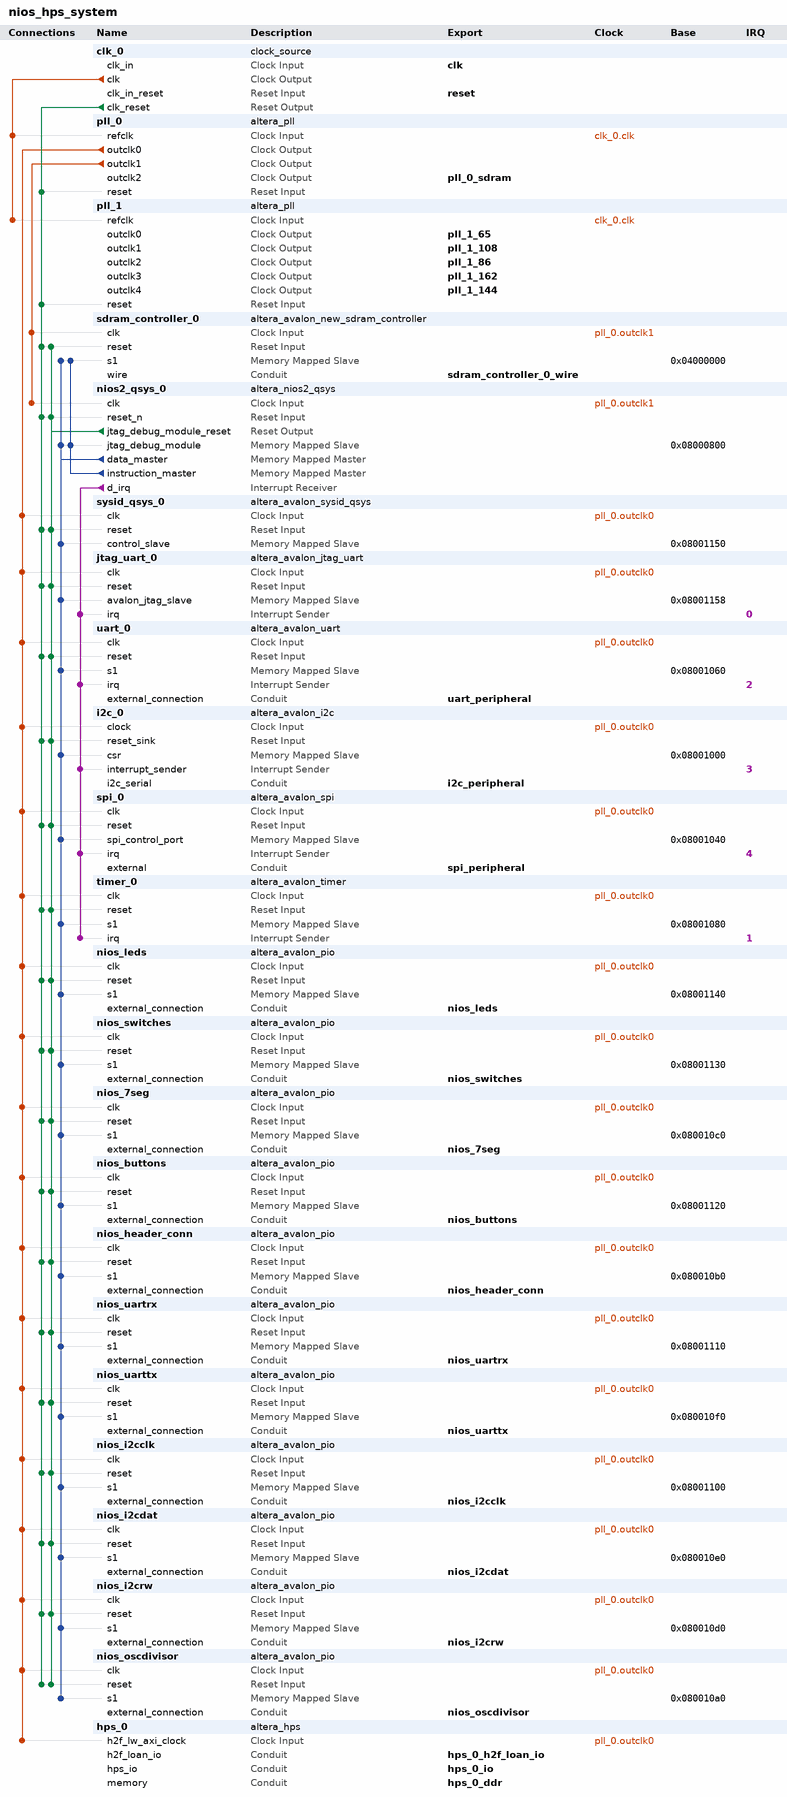
[diagram p0: system contents]
# Platform Designer (Qsys) system nios_hps_system, Cyclone V 5CSEMA5F31C6
# Parameters at their usual value, and those the tool derives, are not listed.
package require -exact qsys 18.1
create_system nios_hps_system
set_project_property DEVICE_FAMILY {Cyclone V}
set_project_property DEVICE 5CSEMA5F31C6

add_instance clk_0 clock_source 18.1
set_instance_parameter_value clk_0 clockFrequency 50000000

add_instance pll_0 altera_pll 18.1
set_instance_parameter_value pll_0 gui_device_speed_grade 1
set_instance_parameter_value pll_0 gui_number_of_clocks 3
set_instance_parameter_value pll_0 gui_operation_mode direct
set_instance_parameter_value pll_0 gui_output_clock_frequency0 50.0
set_instance_parameter_value pll_0 gui_output_clock_frequency1 100.0
set_instance_parameter_value pll_0 gui_output_clock_frequency2 100.0
set_instance_parameter_value pll_0 gui_phase_shift2 -3758
set_instance_parameter_value pll_0 gui_pll_mode {Integer-N PLL}
set_instance_parameter_value pll_0 gui_reference_clock_frequency 50.0
set_instance_parameter_value pll_0 gui_use_locked false

add_instance pll_1 altera_pll 18.1
set_instance_parameter_value pll_1 gui_device_speed_grade 1
set_instance_parameter_value pll_1 gui_number_of_clocks 5
set_instance_parameter_value pll_1 gui_operation_mode direct
set_instance_parameter_value pll_1 gui_output_clock_frequency0 65.0
set_instance_parameter_value pll_1 gui_output_clock_frequency1 108.0
set_instance_parameter_value pll_1 gui_output_clock_frequency2 85.5
set_instance_parameter_value pll_1 gui_output_clock_frequency3 162.0
set_instance_parameter_value pll_1 gui_pll_mode {Integer-N PLL}
set_instance_parameter_value pll_1 gui_reference_clock_frequency 50.0
set_instance_parameter_value pll_1 gui_use_locked false

add_instance sdram_controller_0 altera_avalon_new_sdram_controller 18.1
set_instance_parameter_value sdram_controller_0 TAC 5.4
set_instance_parameter_value sdram_controller_0 TRCD 15.0
set_instance_parameter_value sdram_controller_0 TRP 15.0
set_instance_parameter_value sdram_controller_0 casLatency 3
set_instance_parameter_value sdram_controller_0 columnWidth 10
set_instance_parameter_value sdram_controller_0 dataWidth 16
set_instance_parameter_value sdram_controller_0 generateSimulationModel false
set_instance_parameter_value sdram_controller_0 model single_Micron_MT48LC4M32B2_7_chip
set_instance_parameter_value sdram_controller_0 numberOfBanks 4
set_instance_parameter_value sdram_controller_0 numberOfChipSelects 1
set_instance_parameter_value sdram_controller_0 powerUpDelay 100.0
set_instance_parameter_value sdram_controller_0 refreshPeriod 7.8125
set_instance_parameter_value sdram_controller_0 rowWidth 13

add_instance nios2_qsys_0 altera_nios2_qsys 16.1
set_instance_parameter_value nios2_qsys_0 breakSlave nios2_qsys_0.jtag_debug_module
set_instance_parameter_value nios2_qsys_0 exceptionSlave sdram_controller_0.s1
set_instance_parameter_value nios2_qsys_0 icache_size 4096
set_instance_parameter_value nios2_qsys_0 impl Tiny
set_instance_parameter_value nios2_qsys_0 mmu_TLBMissExcSlave None
set_instance_parameter_value nios2_qsys_0 resetSlave sdram_controller_0.s1
set_instance_parameter_value nios2_qsys_0 resetrequest_enabled true

add_instance sysid_qsys_0 altera_avalon_sysid_qsys 18.1
set_instance_parameter_value sysid_qsys_0 id 0

add_instance jtag_uart_0 altera_avalon_jtag_uart 18.1
set_instance_parameter_value jtag_uart_0 simInteractiveOptions NO_INTERACTIVE_WINDOWS

add_instance uart_0 altera_avalon_uart 18.1
set_instance_parameter_value uart_0 baud 115200
set_instance_parameter_value uart_0 dataBits 8
set_instance_parameter_value uart_0 fixedBaud false
set_instance_parameter_value uart_0 parity EVEN
set_instance_parameter_value uart_0 stopBits 1

add_instance i2c_0 altera_avalon_i2c 18.1
set_instance_parameter_value i2c_0 FIFO_DEPTH 4

add_instance spi_0 altera_avalon_spi 18.1
set_instance_parameter_value spi_0 clockPolarity 0
set_instance_parameter_value spi_0 dataWidth 8
set_instance_parameter_value spi_0 masterSPI true
set_instance_parameter_value spi_0 numberOfSlaves 1
set_instance_parameter_value spi_0 targetClockRate 128000

add_instance timer_0 altera_avalon_timer 18.1
set_instance_parameter_value timer_0 period 1
set_instance_parameter_value timer_0 periodUnits MSEC

add_instance nios_leds altera_avalon_pio 18.1
set_instance_parameter_value nios_leds direction Output
set_instance_parameter_value nios_leds width 10

add_instance nios_switches altera_avalon_pio 18.1
set_instance_parameter_value nios_switches direction Input
set_instance_parameter_value nios_switches width 10

add_instance nios_7seg altera_avalon_pio 18.1
set_instance_parameter_value nios_7seg direction Output
set_instance_parameter_value nios_7seg width 24

add_instance nios_buttons altera_avalon_pio 18.1
set_instance_parameter_value nios_buttons direction Input
set_instance_parameter_value nios_buttons width 4

add_instance nios_header_conn altera_avalon_pio 18.1
set_instance_parameter_value nios_header_conn direction InOut
set_instance_parameter_value nios_header_conn width 32

add_instance nios_uartrx altera_avalon_pio 18.1
set_instance_parameter_value nios_uartrx direction Input
set_instance_parameter_value nios_uartrx width 1

add_instance nios_uarttx altera_avalon_pio 18.1
set_instance_parameter_value nios_uarttx direction Output
set_instance_parameter_value nios_uarttx width 1

add_instance nios_i2cclk altera_avalon_pio 18.1
set_instance_parameter_value nios_i2cclk direction Output
set_instance_parameter_value nios_i2cclk width 1

add_instance nios_i2cdat altera_avalon_pio 18.1
set_instance_parameter_value nios_i2cdat direction InOut
set_instance_parameter_value nios_i2cdat width 1

add_instance nios_i2crw altera_avalon_pio 18.1
set_instance_parameter_value nios_i2crw direction Output
set_instance_parameter_value nios_i2crw width 1

add_instance nios_oscdivisor altera_avalon_pio 18.1
set_instance_parameter_value nios_oscdivisor direction Output
set_instance_parameter_value nios_oscdivisor width 16

add_instance hps_0 altera_hps 18.1
set_instance_parameter_value hps_0 EMAC1_Mode N/A
set_instance_parameter_value hps_0 EMAC1_PinMuxing Unused
set_instance_parameter_value hps_0 F2SCLK_COLDRST_Enable false
set_instance_parameter_value hps_0 F2SCLK_DBGRST_Enable false
set_instance_parameter_value hps_0 F2SCLK_WARMRST_Enable false
set_instance_parameter_value hps_0 F2SINTERRUPT_Enable false
set_instance_parameter_value hps_0 F2S_Width 0
set_instance_parameter_value hps_0 FPGA_PERIPHERAL_OUTPUT_CLOCK_FREQ_EMAC0_GTX_CLK 125
set_instance_parameter_value hps_0 FPGA_PERIPHERAL_OUTPUT_CLOCK_FREQ_EMAC0_MD_CLK 2.5
set_instance_parameter_value hps_0 FPGA_PERIPHERAL_OUTPUT_CLOCK_FREQ_EMAC1_GTX_CLK 125
set_instance_parameter_value hps_0 FPGA_PERIPHERAL_OUTPUT_CLOCK_FREQ_EMAC1_MD_CLK 2.5
set_instance_parameter_value hps_0 HPS_PROTOCOL DDR3
set_instance_parameter_value hps_0 I2C0_Mode N/A
set_instance_parameter_value hps_0 I2C0_PinMuxing Unused
set_instance_parameter_value hps_0 I2C1_Mode N/A
set_instance_parameter_value hps_0 I2C1_PinMuxing Unused
set_instance_parameter_value hps_0 LWH2F_Enable true
set_instance_parameter_value hps_0 MEM_BANKADDR_WIDTH 3
set_instance_parameter_value hps_0 MEM_CLK_FREQ 400.0
set_instance_parameter_value hps_0 MEM_COL_ADDR_WIDTH 10
set_instance_parameter_value hps_0 MEM_DQ_WIDTH 32
set_instance_parameter_value hps_0 MEM_DRV_STR RZQ/7
set_instance_parameter_value hps_0 MEM_ROW_ADDR_WIDTH 15
set_instance_parameter_value hps_0 MEM_RTT_NOM RZQ/4
set_instance_parameter_value hps_0 MEM_RTT_WR RZQ/4
set_instance_parameter_value hps_0 MEM_TCL 11
set_instance_parameter_value hps_0 MEM_TFAW_NS 30.0
set_instance_parameter_value hps_0 MEM_TRAS_NS 35.0
set_instance_parameter_value hps_0 MEM_TRCD_NS 13.75
set_instance_parameter_value hps_0 MEM_TRFC_NS 260.0
set_instance_parameter_value hps_0 MEM_TRP_NS 13.75
set_instance_parameter_value hps_0 MEM_VENDOR Other
set_instance_parameter_value hps_0 MEM_WTCL 8
set_instance_parameter_value hps_0 QSPI_Mode N/A
set_instance_parameter_value hps_0 QSPI_PinMuxing Unused
set_instance_parameter_value hps_0 REF_CLK_FREQ 25.0
set_instance_parameter_value hps_0 S2FCLK_USER2CLK 5
set_instance_parameter_value hps_0 S2F_Width 0
set_instance_parameter_value hps_0 SDIO_Mode {4-bit Data}
set_instance_parameter_value hps_0 SDIO_PinMuxing {HPS I/O Set 0}
set_instance_parameter_value hps_0 SPIM1_Mode N/A
set_instance_parameter_value hps_0 SPIM1_PinMuxing Unused
set_instance_parameter_value hps_0 STM_Enable false
set_instance_parameter_value hps_0 TIMING_BOARD_AC_SKEW 0.02
set_instance_parameter_value hps_0 TIMING_BOARD_AC_TO_CK_SKEW 0.01
set_instance_parameter_value hps_0 TIMING_BOARD_DQ_TO_DQS_SKEW 0.05
set_instance_parameter_value hps_0 TIMING_BOARD_MAX_CK_DELAY 0.03
set_instance_parameter_value hps_0 TIMING_BOARD_MAX_DQS_DELAY 0.02
set_instance_parameter_value hps_0 TIMING_BOARD_SKEW_BETWEEN_DQS 0.06
set_instance_parameter_value hps_0 TIMING_BOARD_SKEW_CKDQS_DIMM_MAX 0.12
set_instance_parameter_value hps_0 TIMING_BOARD_SKEW_CKDQS_DIMM_MIN 0.06
set_instance_parameter_value hps_0 TIMING_BOARD_SKEW_WITHIN_DQS 0.01
set_instance_parameter_value hps_0 TIMING_TDH 65
set_instance_parameter_value hps_0 TIMING_TDQSCK 255
set_instance_parameter_value hps_0 TIMING_TDQSQ 125
set_instance_parameter_value hps_0 TIMING_TDS 30
set_instance_parameter_value hps_0 TIMING_TIH 140
set_instance_parameter_value hps_0 TIMING_TIS 180
set_instance_parameter_value hps_0 TIMING_TQSH 0.4
set_instance_parameter_value hps_0 UART0_Mode N/A
set_instance_parameter_value hps_0 UART0_PinMuxing Unused
set_instance_parameter_value hps_0 USB1_Mode N/A
set_instance_parameter_value hps_0 USB1_PinMuxing Unused
set_instance_parameter_value hps_0 desired_cfg_clk_mhz 100.0
set_instance_parameter_value hps_0 desired_qspi_clk_mhz 400.0

# connections
add_connection clk_0.clk pll_0.refclk clock
add_connection clk_0.clk pll_1.refclk clock
add_connection pll_0.outclk0 hps_0.h2f_lw_axi_clock clock
add_connection pll_0.outclk0 i2c_0.clock clock
add_connection pll_0.outclk0 jtag_uart_0.clk clock
add_connection pll_0.outclk0 nios_7seg.clk clock
add_connection pll_0.outclk0 nios_buttons.clk clock
add_connection pll_0.outclk0 nios_header_conn.clk clock
add_connection pll_0.outclk0 nios_i2cclk.clk clock
add_connection pll_0.outclk0 nios_i2cdat.clk clock
add_connection pll_0.outclk0 nios_i2crw.clk clock
add_connection pll_0.outclk0 nios_leds.clk clock
add_connection pll_0.outclk0 nios_oscdivisor.clk clock
add_connection pll_0.outclk0 nios_switches.clk clock
add_connection pll_0.outclk0 nios_uartrx.clk clock
add_connection pll_0.outclk0 nios_uarttx.clk clock
add_connection pll_0.outclk0 spi_0.clk clock
add_connection pll_0.outclk0 sysid_qsys_0.clk clock
add_connection pll_0.outclk0 timer_0.clk clock
add_connection pll_0.outclk0 uart_0.clk clock
add_connection pll_0.outclk1 nios2_qsys_0.clk clock
add_connection pll_0.outclk1 sdram_controller_0.clk clock
add_connection clk_0.clk_reset i2c_0.reset_sink reset
add_connection clk_0.clk_reset jtag_uart_0.reset reset
add_connection clk_0.clk_reset nios2_qsys_0.reset_n reset
add_connection clk_0.clk_reset nios_7seg.reset reset
add_connection clk_0.clk_reset nios_buttons.reset reset
add_connection clk_0.clk_reset nios_header_conn.reset reset
add_connection clk_0.clk_reset nios_i2cclk.reset reset
add_connection clk_0.clk_reset nios_i2cdat.reset reset
add_connection clk_0.clk_reset nios_i2crw.reset reset
add_connection clk_0.clk_reset nios_leds.reset reset
add_connection clk_0.clk_reset nios_oscdivisor.reset reset
add_connection clk_0.clk_reset nios_switches.reset reset
add_connection clk_0.clk_reset nios_uartrx.reset reset
add_connection clk_0.clk_reset nios_uarttx.reset reset
add_connection clk_0.clk_reset pll_0.reset reset
add_connection clk_0.clk_reset pll_1.reset reset
add_connection clk_0.clk_reset sdram_controller_0.reset reset
add_connection clk_0.clk_reset spi_0.reset reset
add_connection clk_0.clk_reset sysid_qsys_0.reset reset
add_connection clk_0.clk_reset timer_0.reset reset
add_connection clk_0.clk_reset uart_0.reset reset
add_connection nios2_qsys_0.jtag_debug_module_reset i2c_0.reset_sink reset
add_connection nios2_qsys_0.jtag_debug_module_reset jtag_uart_0.reset reset
add_connection nios2_qsys_0.jtag_debug_module_reset nios2_qsys_0.reset_n reset
add_connection nios2_qsys_0.jtag_debug_module_reset nios_7seg.reset reset
add_connection nios2_qsys_0.jtag_debug_module_reset nios_buttons.reset reset
add_connection nios2_qsys_0.jtag_debug_module_reset nios_header_conn.reset reset
add_connection nios2_qsys_0.jtag_debug_module_reset nios_i2cclk.reset reset
add_connection nios2_qsys_0.jtag_debug_module_reset nios_i2cdat.reset reset
add_connection nios2_qsys_0.jtag_debug_module_reset nios_i2crw.reset reset
add_connection nios2_qsys_0.jtag_debug_module_reset nios_leds.reset reset
add_connection nios2_qsys_0.jtag_debug_module_reset nios_oscdivisor.reset reset
add_connection nios2_qsys_0.jtag_debug_module_reset nios_switches.reset reset
add_connection nios2_qsys_0.jtag_debug_module_reset nios_uartrx.reset reset
add_connection nios2_qsys_0.jtag_debug_module_reset nios_uarttx.reset reset
add_connection nios2_qsys_0.jtag_debug_module_reset sdram_controller_0.reset reset
add_connection nios2_qsys_0.jtag_debug_module_reset spi_0.reset reset
add_connection nios2_qsys_0.jtag_debug_module_reset sysid_qsys_0.reset reset
add_connection nios2_qsys_0.jtag_debug_module_reset timer_0.reset reset
add_connection nios2_qsys_0.jtag_debug_module_reset uart_0.reset reset
add_connection nios2_qsys_0.data_master i2c_0.csr avalon
set_connection_parameter_value nios2_qsys_0.data_master/i2c_0.csr baseAddress 0x08001000
add_connection nios2_qsys_0.data_master jtag_uart_0.avalon_jtag_slave avalon
set_connection_parameter_value nios2_qsys_0.data_master/jtag_uart_0.avalon_jtag_slave baseAddress 0x08001158
add_connection nios2_qsys_0.data_master nios2_qsys_0.jtag_debug_module avalon
set_connection_parameter_value nios2_qsys_0.data_master/nios2_qsys_0.jtag_debug_module baseAddress 0x08000800
add_connection nios2_qsys_0.data_master nios_7seg.s1 avalon
set_connection_parameter_value nios2_qsys_0.data_master/nios_7seg.s1 baseAddress 0x080010c0
add_connection nios2_qsys_0.data_master nios_buttons.s1 avalon
set_connection_parameter_value nios2_qsys_0.data_master/nios_buttons.s1 baseAddress 0x08001120
add_connection nios2_qsys_0.data_master nios_header_conn.s1 avalon
set_connection_parameter_value nios2_qsys_0.data_master/nios_header_conn.s1 baseAddress 0x080010b0
add_connection nios2_qsys_0.data_master nios_i2cclk.s1 avalon
set_connection_parameter_value nios2_qsys_0.data_master/nios_i2cclk.s1 baseAddress 0x08001100
add_connection nios2_qsys_0.data_master nios_i2cdat.s1 avalon
set_connection_parameter_value nios2_qsys_0.data_master/nios_i2cdat.s1 baseAddress 0x080010e0
add_connection nios2_qsys_0.data_master nios_i2crw.s1 avalon
set_connection_parameter_value nios2_qsys_0.data_master/nios_i2crw.s1 baseAddress 0x080010d0
add_connection nios2_qsys_0.data_master nios_leds.s1 avalon
set_connection_parameter_value nios2_qsys_0.data_master/nios_leds.s1 baseAddress 0x08001140
add_connection nios2_qsys_0.data_master nios_oscdivisor.s1 avalon
set_connection_parameter_value nios2_qsys_0.data_master/nios_oscdivisor.s1 baseAddress 0x080010a0
add_connection nios2_qsys_0.data_master nios_switches.s1 avalon
set_connection_parameter_value nios2_qsys_0.data_master/nios_switches.s1 baseAddress 0x08001130
add_connection nios2_qsys_0.data_master nios_uartrx.s1 avalon
set_connection_parameter_value nios2_qsys_0.data_master/nios_uartrx.s1 baseAddress 0x08001110
add_connection nios2_qsys_0.data_master nios_uarttx.s1 avalon
set_connection_parameter_value nios2_qsys_0.data_master/nios_uarttx.s1 baseAddress 0x080010f0
add_connection nios2_qsys_0.data_master sdram_controller_0.s1 avalon
set_connection_parameter_value nios2_qsys_0.data_master/sdram_controller_0.s1 baseAddress 0x04000000
add_connection nios2_qsys_0.data_master spi_0.spi_control_port avalon
set_connection_parameter_value nios2_qsys_0.data_master/spi_0.spi_control_port baseAddress 0x08001040
add_connection nios2_qsys_0.data_master sysid_qsys_0.control_slave avalon
set_connection_parameter_value nios2_qsys_0.data_master/sysid_qsys_0.control_slave baseAddress 0x08001150
add_connection nios2_qsys_0.data_master timer_0.s1 avalon
set_connection_parameter_value nios2_qsys_0.data_master/timer_0.s1 baseAddress 0x08001080
add_connection nios2_qsys_0.data_master uart_0.s1 avalon
set_connection_parameter_value nios2_qsys_0.data_master/uart_0.s1 baseAddress 0x08001060
add_connection nios2_qsys_0.instruction_master nios2_qsys_0.jtag_debug_module avalon
set_connection_parameter_value nios2_qsys_0.instruction_master/nios2_qsys_0.jtag_debug_module baseAddress 0x08000800
add_connection nios2_qsys_0.instruction_master sdram_controller_0.s1 avalon
set_connection_parameter_value nios2_qsys_0.instruction_master/sdram_controller_0.s1 baseAddress 0x04000000
add_connection nios2_qsys_0.d_irq i2c_0.interrupt_sender interrupt
set_connection_parameter_value nios2_qsys_0.d_irq/i2c_0.interrupt_sender irqNumber 3
add_connection nios2_qsys_0.d_irq jtag_uart_0.irq interrupt
set_connection_parameter_value nios2_qsys_0.d_irq/jtag_uart_0.irq irqNumber 0
add_connection nios2_qsys_0.d_irq spi_0.irq interrupt
set_connection_parameter_value nios2_qsys_0.d_irq/spi_0.irq irqNumber 4
add_connection nios2_qsys_0.d_irq timer_0.irq interrupt
set_connection_parameter_value nios2_qsys_0.d_irq/timer_0.irq irqNumber 1
add_connection nios2_qsys_0.d_irq uart_0.irq interrupt
set_connection_parameter_value nios2_qsys_0.d_irq/uart_0.irq irqNumber 2

# exported interfaces
add_interface clk clock sink
set_interface_property clk EXPORT_OF clk_0.clk_in
add_interface hps_0_ddr conduit end
set_interface_property hps_0_ddr EXPORT_OF hps_0.memory
add_interface hps_0_h2f_loan_io conduit end
set_interface_property hps_0_h2f_loan_io EXPORT_OF hps_0.h2f_loan_io
add_interface hps_0_io conduit end
set_interface_property hps_0_io EXPORT_OF hps_0.hps_io
add_interface i2c_peripheral conduit end
set_interface_property i2c_peripheral EXPORT_OF i2c_0.i2c_serial
add_interface nios_7seg conduit end
set_interface_property nios_7seg EXPORT_OF nios_7seg.external_connection
add_interface nios_buttons conduit end
set_interface_property nios_buttons EXPORT_OF nios_buttons.external_connection
add_interface nios_header_conn conduit end
set_interface_property nios_header_conn EXPORT_OF nios_header_conn.external_connection
add_interface nios_i2cclk conduit end
set_interface_property nios_i2cclk EXPORT_OF nios_i2cclk.external_connection
add_interface nios_i2cdat conduit end
set_interface_property nios_i2cdat EXPORT_OF nios_i2cdat.external_connection
add_interface nios_i2crw conduit end
set_interface_property nios_i2crw EXPORT_OF nios_i2crw.external_connection
add_interface nios_leds conduit end
set_interface_property nios_leds EXPORT_OF nios_leds.external_connection
add_interface nios_oscdivisor conduit end
set_interface_property nios_oscdivisor EXPORT_OF nios_oscdivisor.external_connection
add_interface nios_switches conduit end
set_interface_property nios_switches EXPORT_OF nios_switches.external_connection
add_interface nios_uartrx conduit end
set_interface_property nios_uartrx EXPORT_OF nios_uartrx.external_connection
add_interface nios_uarttx conduit end
set_interface_property nios_uarttx EXPORT_OF nios_uarttx.external_connection
add_interface pll_0_sdram clock source
set_interface_property pll_0_sdram EXPORT_OF pll_0.outclk2
add_interface pll_1_108 clock source
set_interface_property pll_1_108 EXPORT_OF pll_1.outclk1
add_interface pll_1_144 clock source
set_interface_property pll_1_144 EXPORT_OF pll_1.outclk4
add_interface pll_1_162 clock source
set_interface_property pll_1_162 EXPORT_OF pll_1.outclk3
add_interface pll_1_65 clock source
set_interface_property pll_1_65 EXPORT_OF pll_1.outclk0
add_interface pll_1_86 clock source
set_interface_property pll_1_86 EXPORT_OF pll_1.outclk2
add_interface reset reset sink
set_interface_property reset EXPORT_OF clk_0.clk_in_reset
add_interface sdram_controller_0_wire conduit end
set_interface_property sdram_controller_0_wire EXPORT_OF sdram_controller_0.wire
add_interface spi_peripheral conduit end
set_interface_property spi_peripheral EXPORT_OF spi_0.external
add_interface uart_peripheral conduit end
set_interface_property uart_peripheral EXPORT_OF uart_0.external_connection

set_interconnect_requirement {$system} qsys_mm.clockCrossingAdapter HANDSHAKE
set_interconnect_requirement {$system} qsys_mm.enableEccProtection FALSE
set_interconnect_requirement {$system} qsys_mm.insertDefaultSlave FALSE
set_interconnect_requirement {$system} qsys_mm.maxAdditionalLatency 1

save_system nios_hps_system.qsys
